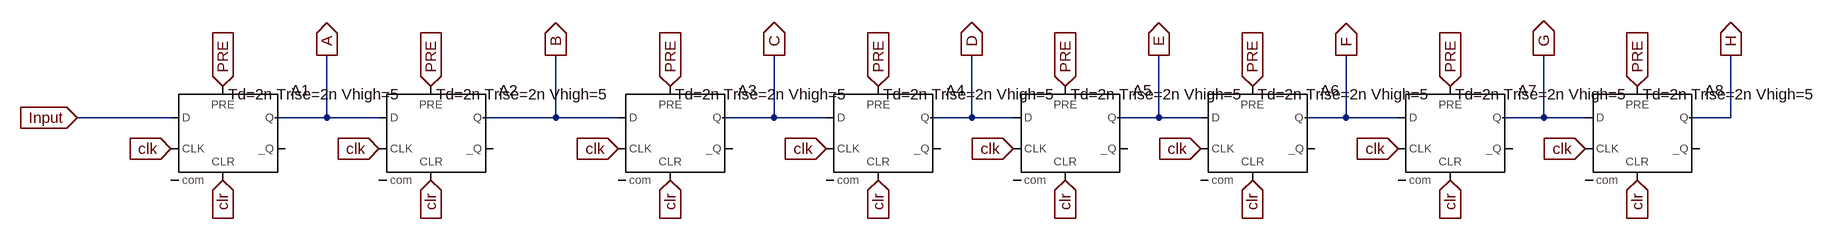
[diagram p0: schematic shift_register.asc]
shift_register.asc, the LTspice schematic file:
Version 4.1
SHEET 1 2264 680
WIRE -320 112 -464 112
WIRE -80 112 -80 16
WIRE -80 112 -160 112
WIRE 0 112 -80 112
WIRE 272 112 272 16
WIRE 272 112 160 112
WIRE 368 112 272 112
WIRE 608 112 608 16
WIRE 608 112 528 112
WIRE 688 112 608 112
WIRE 912 112 912 16
WIRE 912 112 848 112
WIRE 976 112 912 112
WIRE 1200 112 1200 16
WIRE 1200 112 1136 112
WIRE 1264 112 1200 112
WIRE 1488 112 1488 16
WIRE 1488 112 1424 112
WIRE 1568 112 1488 112
WIRE 1792 112 1792 16
WIRE 1792 112 1728 112
WIRE 1856 112 1792 112
WIRE 2080 112 2080 16
WIRE 2080 112 2016 112
FLAG 0 160 clk
IOPIN 0 160 In
FLAG 368 160 clk
IOPIN 368 160 In
FLAG -320 160 clk
IOPIN -320 160 In
FLAG 688 160 clk
IOPIN 688 160 In
FLAG 976 160 clk
IOPIN 976 160 In
FLAG 1264 160 clk
IOPIN 1264 160 In
FLAG 1568 160 clk
IOPIN 1568 160 In
FLAG 1856 160 clk
IOPIN 1856 160 In
FLAG -240 208 clr
IOPIN -240 208 In
FLAG 80 208 clr
IOPIN 80 208 In
FLAG 448 208 clr
IOPIN 448 208 In
FLAG 768 208 clr
IOPIN 768 208 In
FLAG 1056 208 clr
IOPIN 1056 208 In
FLAG 1344 208 clr
IOPIN 1344 208 In
FLAG 1648 208 clr
IOPIN 1648 208 In
FLAG 1936 208 clr
IOPIN 1936 208 In
FLAG -464 112 Input
IOPIN -464 112 In
FLAG -80 16 A
IOPIN -80 16 Out
FLAG 272 16 B
IOPIN 272 16 Out
FLAG 608 16 C
IOPIN 608 16 Out
FLAG 912 16 D
IOPIN 912 16 Out
FLAG 1200 16 E
IOPIN 1200 16 Out
FLAG 1488 16 F
IOPIN 1488 16 Out
FLAG 1792 16 G
IOPIN 1792 16 Out
FLAG 2080 16 H
IOPIN 2080 16 Out
FLAG -240 64 PRE
IOPIN -240 64 In
FLAG 80 64 PRE
IOPIN 80 64 In
FLAG 448 64 PRE
IOPIN 448 64 In
FLAG 768 64 PRE
IOPIN 768 64 In
FLAG 1056 64 PRE
IOPIN 1056 64 In
FLAG 1344 64 PRE
IOPIN 1344 64 In
FLAG 1648 64 PRE
IOPIN 1648 64 In
FLAG 1936 64 PRE
IOPIN 1936 64 In
SYMBOL Digital\\dflop -240 64 R0
WINDOW 39 8 12 Left 2
SYMATTR SpiceLine Td=2n Trise=2n Vhigh=5
SYMATTR InstName A1
SYMBOL Digital\\dflop 80 64 R0
WINDOW 39 8 12 Left 2
SYMATTR SpiceLine Td=2n Trise=2n Vhigh=5
SYMATTR InstName A2
SYMBOL Digital\\dflop 448 64 R0
WINDOW 39 8 12 Left 2
SYMATTR SpiceLine Td=2n Trise=2n Vhigh=5
SYMATTR InstName A3
SYMBOL Digital\\dflop 768 64 R0
WINDOW 39 8 12 Left 2
SYMATTR SpiceLine Td=2n Trise=2n Vhigh=5
SYMATTR InstName A4
SYMBOL Digital\\dflop 1056 64 R0
WINDOW 39 8 12 Left 2
SYMATTR SpiceLine Td=2n Trise=2n Vhigh=5
SYMATTR InstName A5
SYMBOL Digital\\dflop 1344 64 R0
WINDOW 39 8 12 Left 2
SYMATTR SpiceLine Td=2n Trise=2n Vhigh=5
SYMATTR InstName A6
SYMBOL Digital\\dflop 1648 64 R0
WINDOW 39 8 12 Left 2
SYMATTR SpiceLine Td=2n Trise=2n Vhigh=5
SYMATTR InstName A7
SYMBOL Digital\\dflop 1936 64 R0
WINDOW 39 8 12 Left 2
SYMATTR SpiceLine Td=2n Trise=2n Vhigh=5
SYMATTR InstName A8

The netlist it stands for:
* shift_register.asc
A1 Input 0 clk PRE clr 0 A 0 DFLOP Td=2n Trise=2n Vhigh=5
A2 A 0 clk PRE clr 0 B 0 DFLOP Td=2n Trise=2n Vhigh=5
A3 B 0 clk PRE clr 0 C 0 DFLOP Td=2n Trise=2n Vhigh=5
A4 C 0 clk PRE clr 0 D 0 DFLOP Td=2n Trise=2n Vhigh=5
A5 D 0 clk PRE clr 0 E 0 DFLOP Td=2n Trise=2n Vhigh=5
A6 E 0 clk PRE clr 0 F 0 DFLOP Td=2n Trise=2n Vhigh=5
A7 F 0 clk PRE clr 0 G 0 DFLOP Td=2n Trise=2n Vhigh=5
A8 G 0 clk PRE clr 0 H 0 DFLOP Td=2n Trise=2n Vhigh=5
.backanno
.end